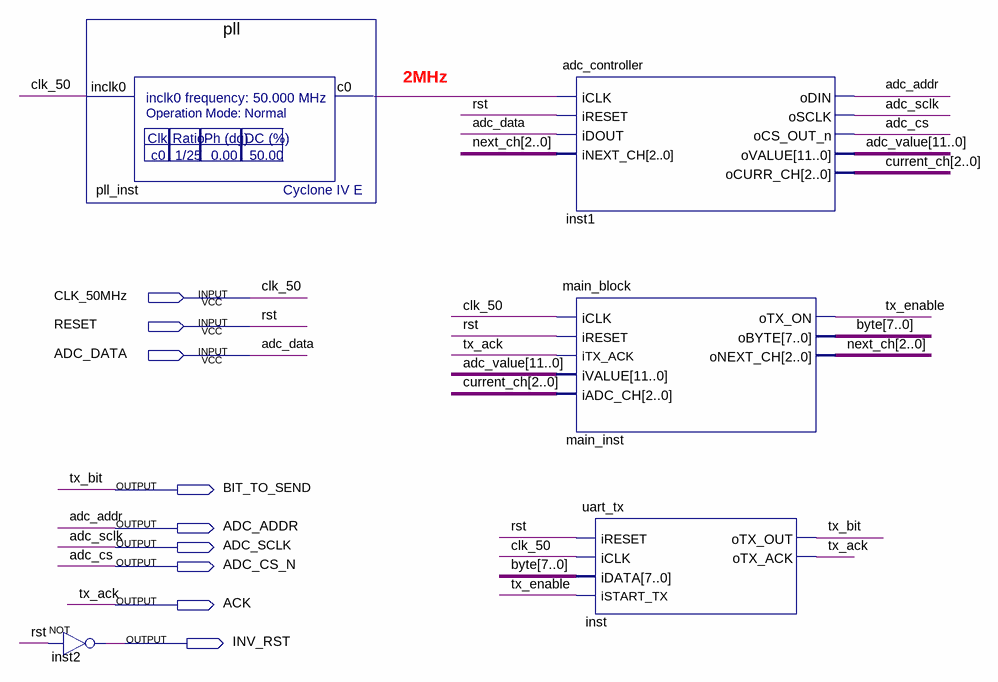
[diagram p0: schematic sheet]
// Quartus schematic proyecto_mise.bdf as structural Verilog: 5 symbols, 9 pins
module proyecto_mise (
  input  CLK_50MHz,
  input  RESET,
  input  ADC_DATA,
  output BIT_TO_SEND,
  output ADC_ADDR,
  output ADC_SCLK,
  output ADC_CS_N,
  output ACK,
  output INV_RST
);

  wire pll_inst_c0, tx_enable;
  wire [2:0] current_ch, next_ch;
  wire [7:0] \byte ;
  wire [11:0] adc_value;

  not inst2 (INV_RST, RESET);
  pll pll_inst (.inclk0(CLK_50MHz), .c0(pll_inst_c0));
  adc_controller inst1 (
    .iCLK(pll_inst_c0), .iRESET(RESET), .iDOUT(ADC_DATA), .iNEXT_CH(next_ch), .oDIN(ADC_ADDR),
    .oSCLK(ADC_SCLK), .oCS_OUT_n(ADC_CS_N), .oVALUE(adc_value), .oCURR_CH(current_ch));
  main_block main_inst (
    .iCLK(CLK_50MHz), .iRESET(RESET), .iTX_ACK(ACK), .iVALUE(adc_value), .iADC_CH(current_ch),
    .oTX_ON(tx_enable), .oBYTE(\byte ), .oNEXT_CH(next_ch));
  uart_tx inst (
    .iRESET(RESET), .iCLK(CLK_50MHz), .iDATA(\byte ), .iSTART_TX(tx_enable), .oTX_OUT(BIT_TO_SEND),
    .oTX_ACK(ACK));

  // Other names for the same wires on the sheet: adc_cs = ADC_CS_N; clk_50 = CLK_50MHz; rst = RESET; tx_ack = ACK;
  //   tx_bit = BIT_TO_SEND

  // Notes on the sheet:
  //   2MHz
endmodule
